# EAGLE design 06_MOV16_DestinationRegister (EAGLE 7.5.0)
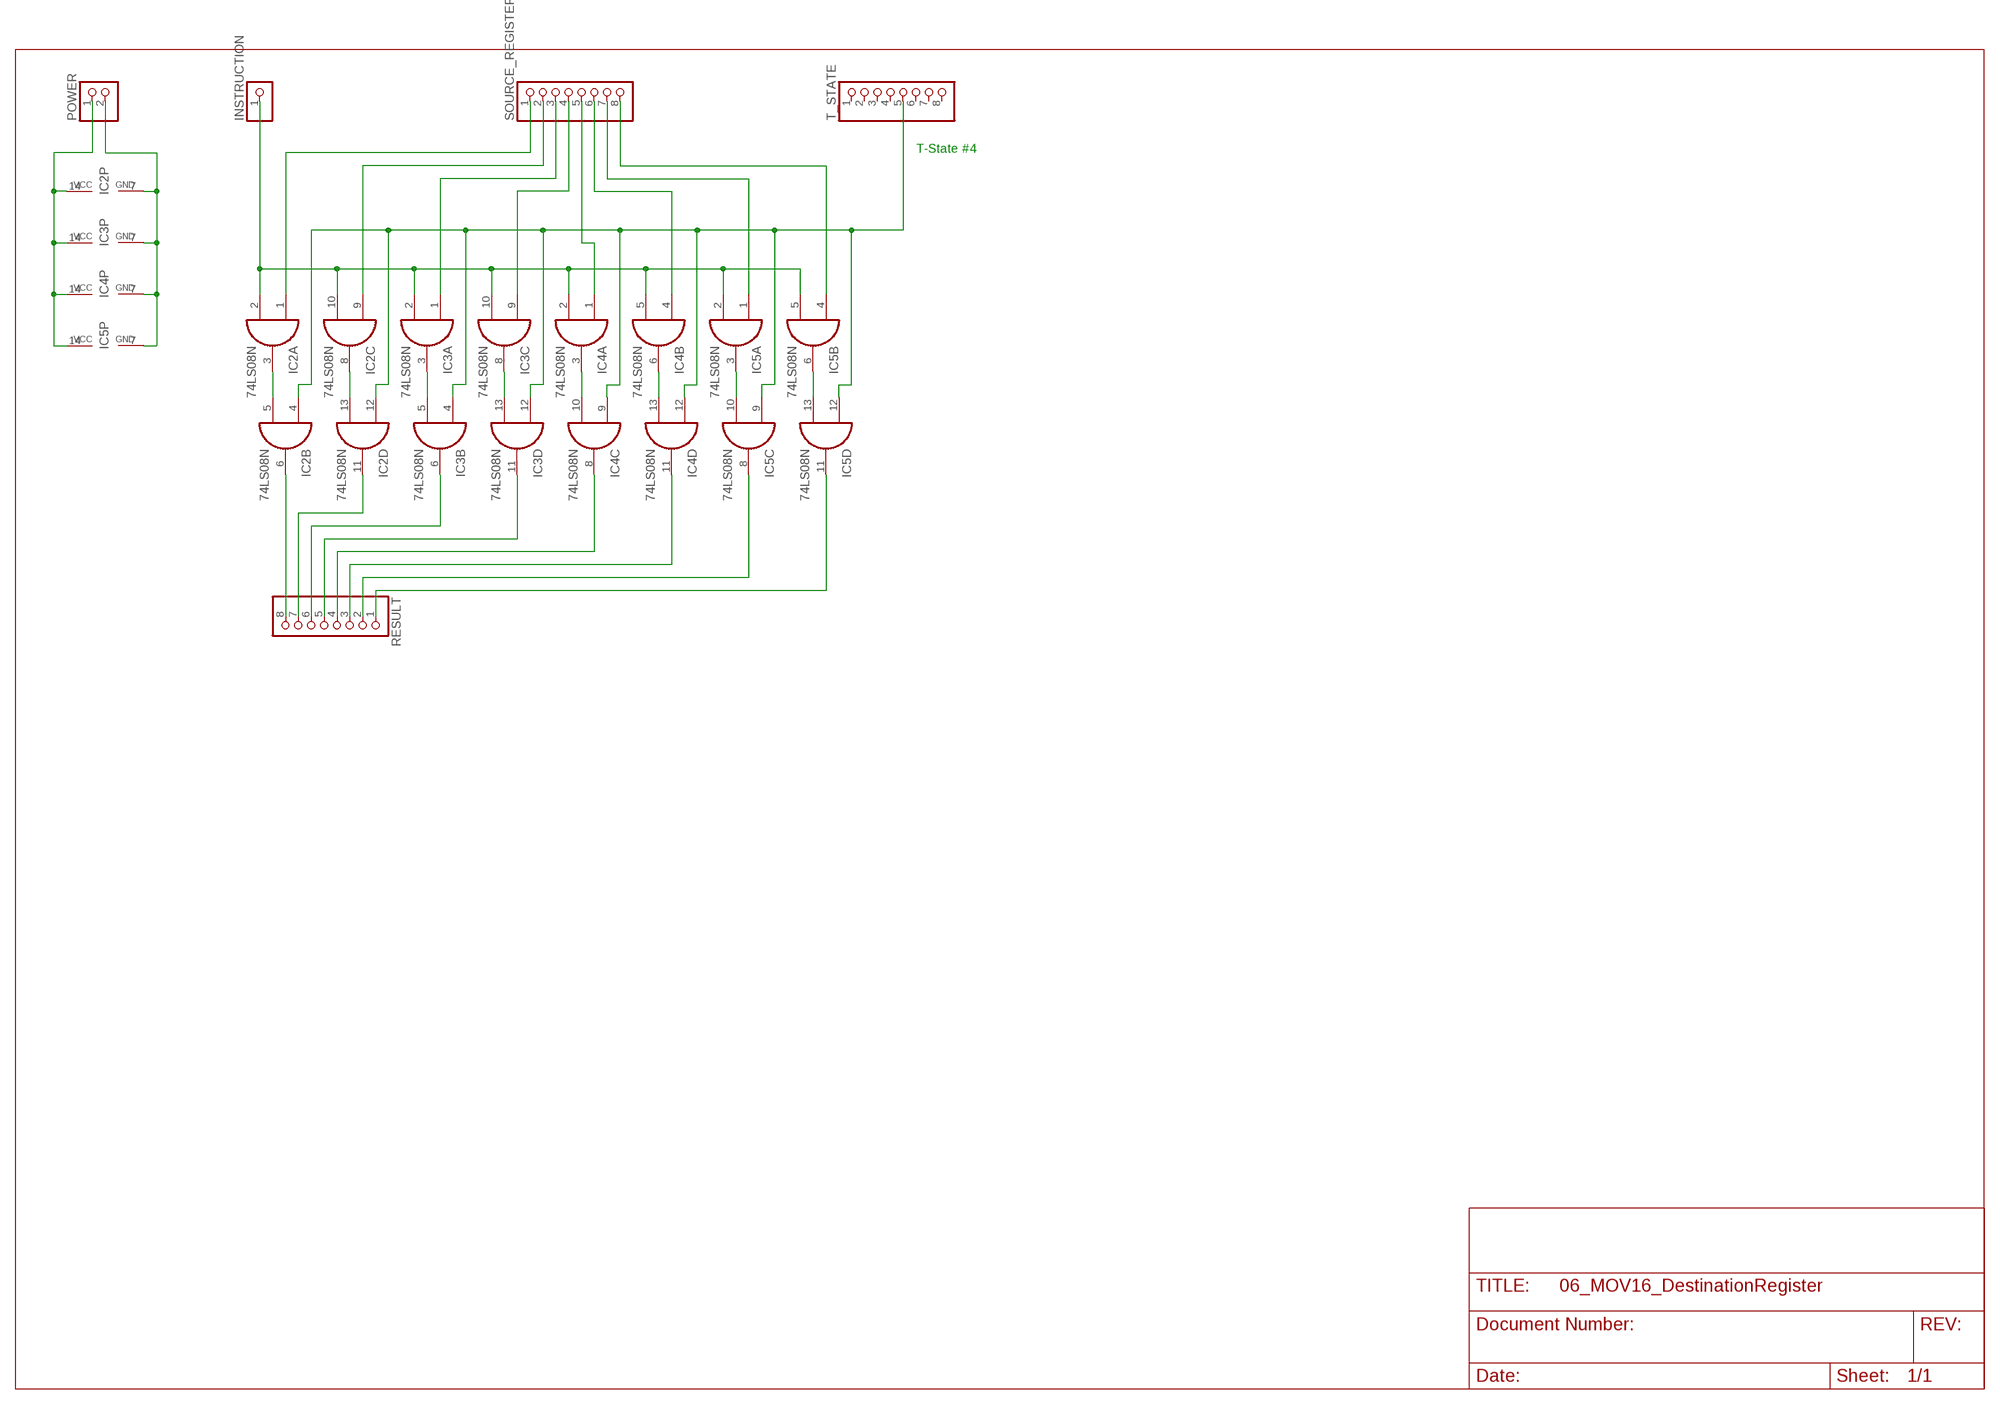
[diagram p0: schematic, sheet 1]

## Parts
IC2  74LS08N  [DIL14]
IC3  74LS08N  [DIL14]
IC4  74LS08N  [DIL14]
IC5  74LS08N  [DIL14]
INSTRUCTION  PINHD-1X1  [1X01]
POWER  PINHD-1X2  [1X02]
RESULT  PINHD-1X8  [1X08]
SOURCE_REGISTER  PINHD-1X8  [1X08]
T_STATE  PINHD-1X8  [1X08]

## Nets
GND: IC2.7(P:GND) IC3.7(P:GND) IC4.7(P:GND) IC5.7(P:GND) POWER.2
N$1: IC2.4(B:I0) IC2.12(D:I0) IC3.4(B:I0) IC3.12(D:I0) IC4.9(C:I0) IC4.12(D:I0) IC5.9(C:I0) IC5.12(D:I0) T_STATE.5
N$3: IC2.2(A:I1) IC2.10(C:I1) IC3.2(A:I1) IC3.10(C:I1) IC4.2(A:I1) IC4.5(B:I1) IC5.2(A:I1) IC5.5(B:I1) INSTRUCTION.1
N$4: IC2.1(A:I0) SOURCE_REGISTER.1
N$5: IC2.3(A:O) IC2.5(B:I1)
N$7: IC2.6(B:O) RESULT.8
N$8: IC2.9(C:I0) SOURCE_REGISTER.2
N$9: IC2.8(C:O) IC2.13(D:I1)
N$10: IC3.1(A:I0) SOURCE_REGISTER.3
N$11: IC2.11(D:O) RESULT.7
N$12: IC3.3(A:O) IC3.5(B:I1)
N$13: IC3.6(B:O) RESULT.6
N$14: IC3.9(C:I0) SOURCE_REGISTER.4
N$15: IC3.8(C:O) IC3.13(D:I1)
N$16: IC3.11(D:O) RESULT.5
N$17: IC4.1(A:I0) SOURCE_REGISTER.5
N$18: IC4.3(A:O) IC4.10(C:I1)
N$20: IC4.8(C:O) RESULT.4
N$21: IC4.4(B:I0) SOURCE_REGISTER.6
N$22: IC4.6(B:O) IC4.13(D:I1)
N$24: IC4.11(D:O) RESULT.3
N$25: IC5.1(A:I0) SOURCE_REGISTER.7
N$26: IC5.3(A:O) IC5.10(C:I1)
N$27: IC5.8(C:O) RESULT.2
N$28: IC5.4(B:I0) SOURCE_REGISTER.8
N$29: IC5.6(B:O) IC5.13(D:I1)
N$31: IC5.11(D:O) RESULT.1
VCC: IC2.14(P:VCC) IC3.14(P:VCC) IC4.14(P:VCC) IC5.14(P:VCC) POWER.1
Unconnected: T_STATE.1 T_STATE.2 T_STATE.3 T_STATE.4 T_STATE.6 T_STATE.7 T_STATE.8

## Notes on the sheet
- T-State #4

## Library data of the parts
IC2-IC5 = 74xx-eu:74*08: Quad 2-input AND gate
INSTRUCTION = pinhead:PINHD-1X1: PIN HEADER
POWER = pinhead:PINHD-1X2: PIN HEADER
RESULT SOURCE_REGISTER T_STATE = pinhead:PINHD-1X8: PIN HEADER

## Board
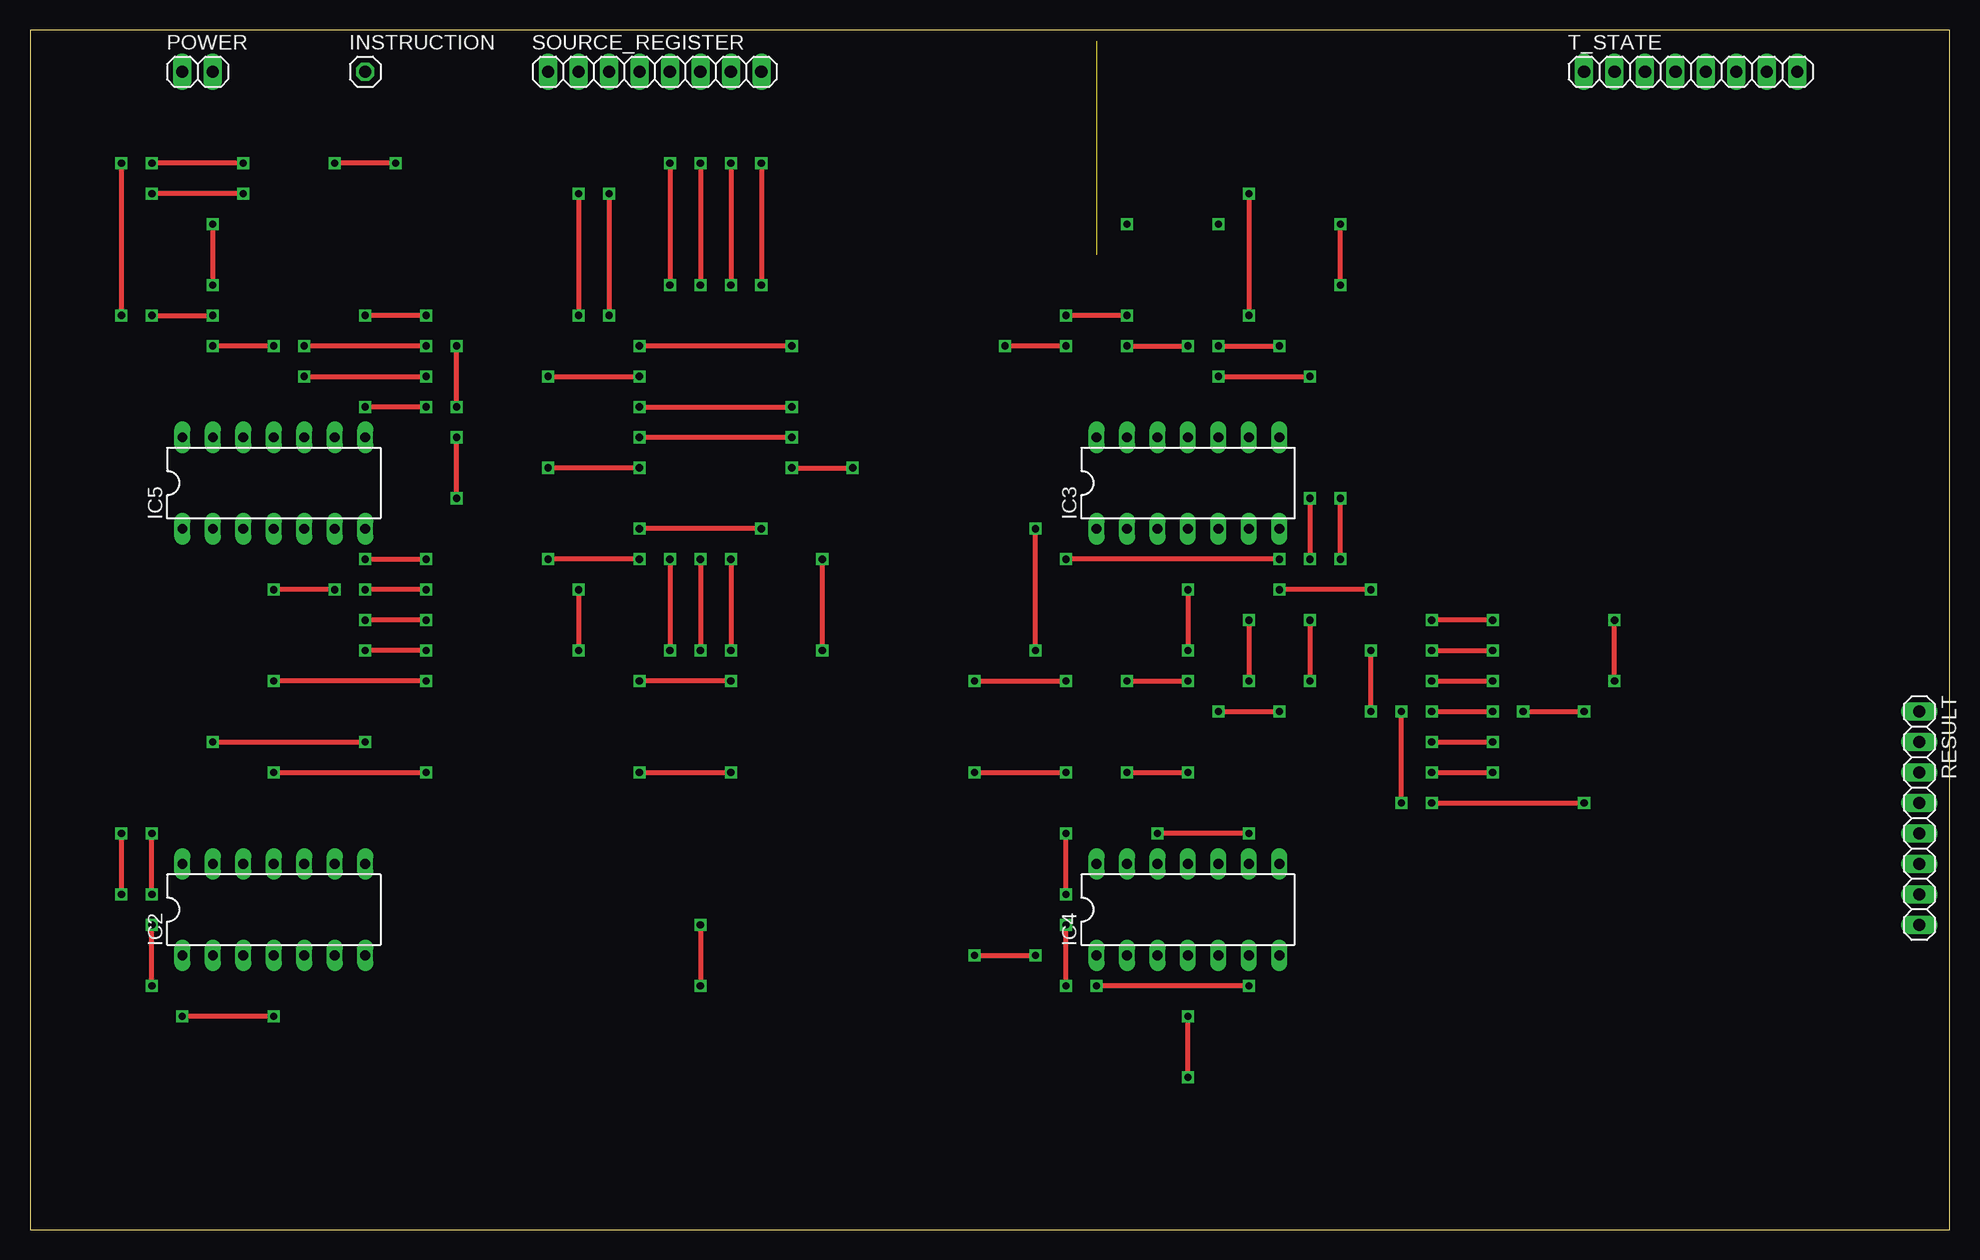
[diagram p1: board, top side]
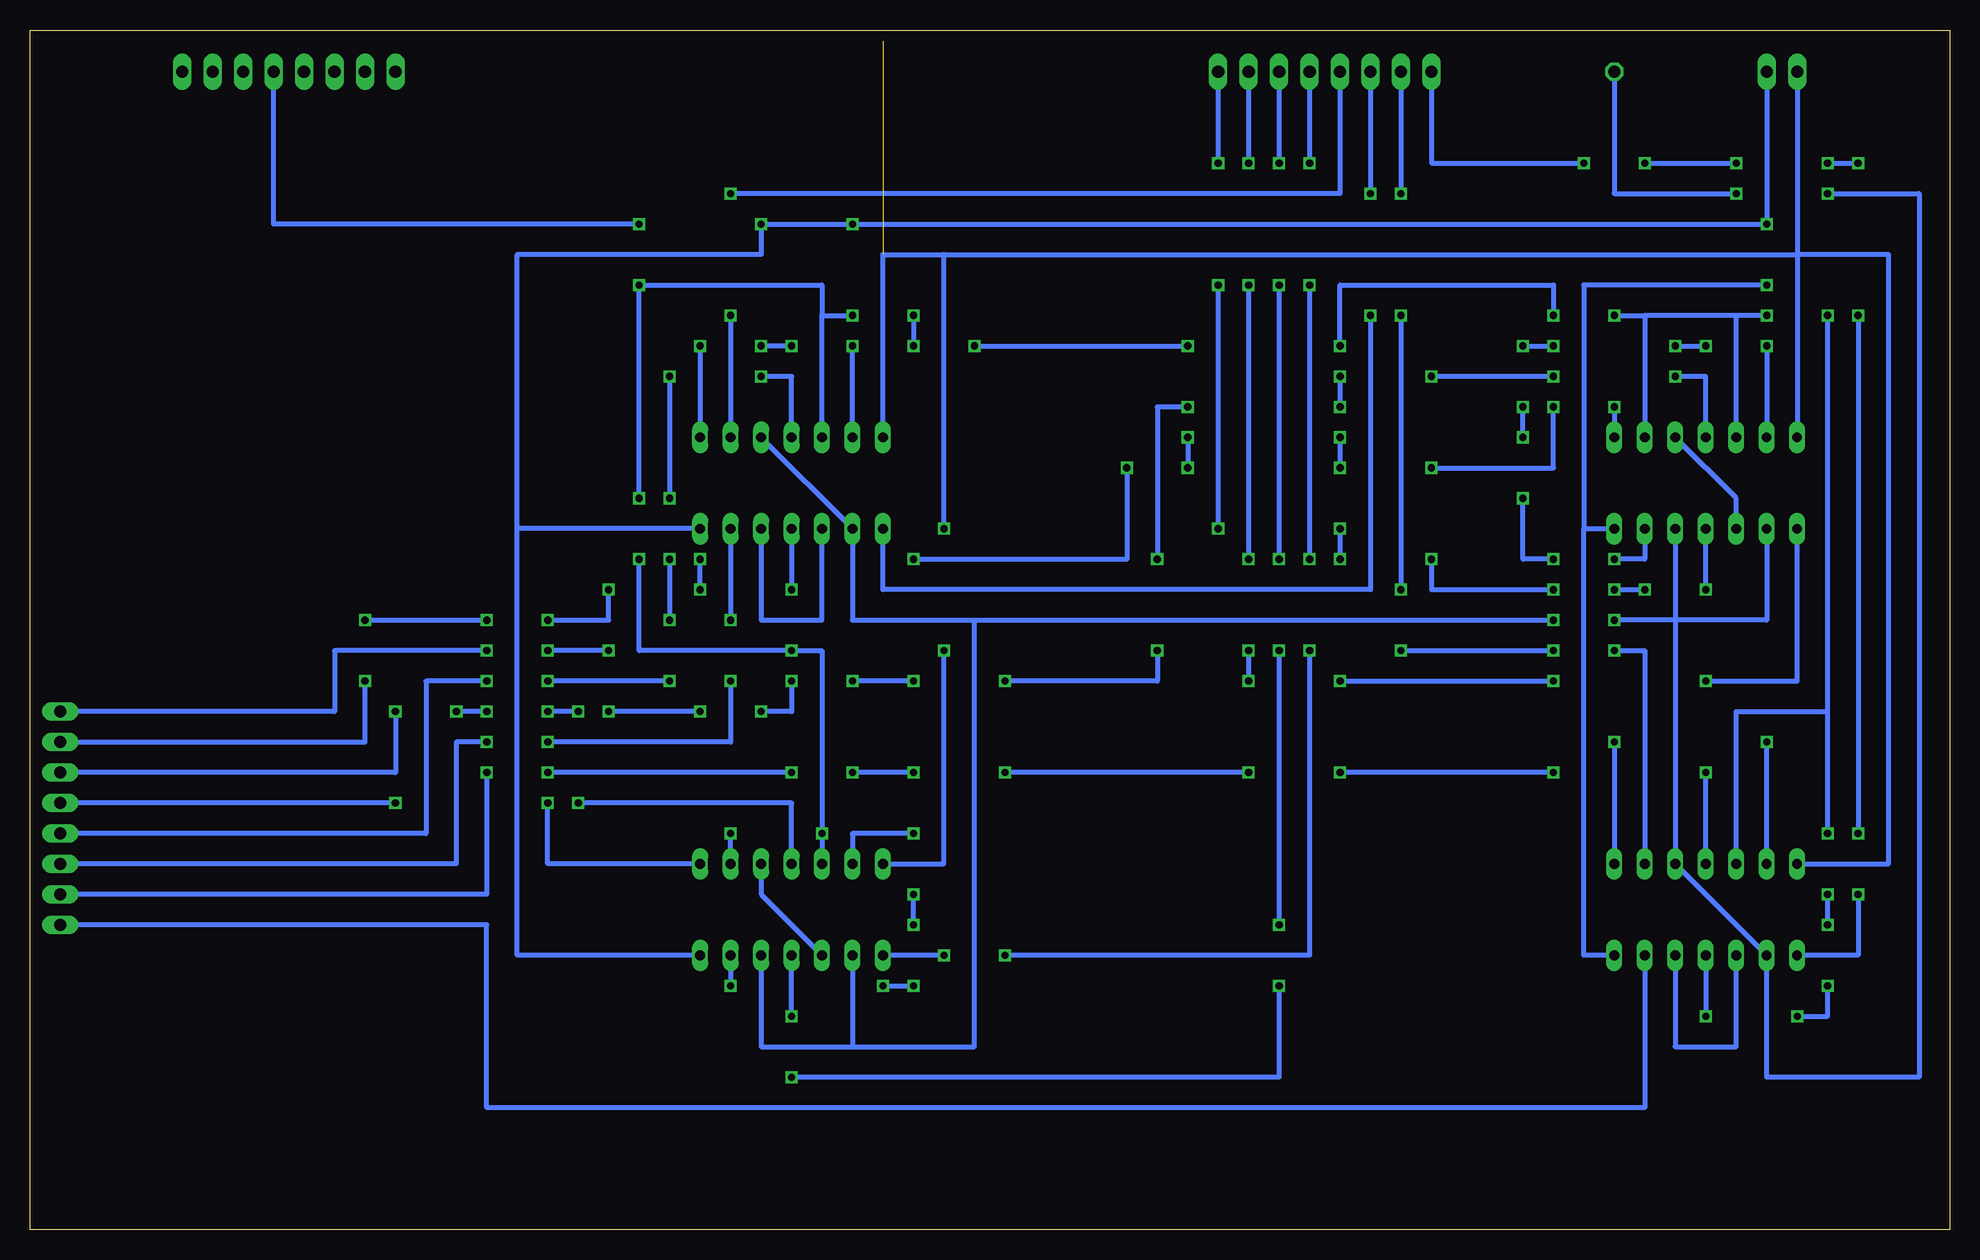
[diagram p2: board, bottom side, seen from below]

Size 160 x 100 mm. Coordinates in mm from the lower left corner, seen from the top.
Outline: 0,0 160,0 160,100 0,100 0,0
Copper layers (1*16): Top 0.035mm / dielectric 1.5mm / Bottom 0.035mm
Design rules "default": minimum track width 10mil, minimum drill 24mil, track to track 8mil, track to pad 8mil, pad to pad 8mil, via to via 8mil, smd to smd 8mil, copper to edge 40mil, drill to drill 8mil, minimum pad ring 10mil, minimum via ring 8mil, stop-mask expansion 4mil, vias tented up to drill 0mil, thermal gap 10mil

### Footprints (pad centres in the part's own frame; a part is rotated, then mirrored left to right if it is on the bottom)
DIL14 = drill 0.813 long: 1 -7.62,-3.81; 2 -5.08,-3.81; 3 -2.54,-3.81; 4 0,-3.81; 5 2.54,-3.81; 6 5.08,-3.81; 7 7.62,-3.81; 8 7.62,3.81; 9 5.08,3.81; 10 2.54,3.81; 11 0,3.81; 12 -2.54,3.81; 13 -5.08,3.81; 14 -7.62,3.81
1X01 = drill 1.016 octagon: 1 0,0
1X02 = drill 1.016 long: 1 -1.27,0; 2 1.27,0
1X08 = drill 1.016 long: 1 -8.89,0; 2 -6.35,0; 3 -3.81,0; 4 -1.27,0; 5 1.27,0; 6 3.81,0; 7 6.35,0; 8 8.89,0

### Placement (x,y rotation side)
IC2  20.32,26.67 0 top
IC3  96.52,62.23 0 top
IC4  96.52,26.67 0 top
IC5  20.32,62.23 0 top
INSTRUCTION  27.94,96.52 0 top
POWER  13.97,96.52 0 top
RESULT  157.48,34.29 270 top
SOURCE_REGISTER  52.07,96.52 0 top
T_STATE  138.43,96.52 0 top

### Tracks (layer width: path | path; a pad name or v marks a point on that pad's centre or on a via)
GND  (via drill 0.6)
  Top 0.406: v15.24,83.82 v15.24,78.74
  Bottom 0.406: POWER.2 v15.24,83.82 v99.06,83.82 99.06,81.28 119.38,81.28 119.38,58.42 | v15.24,78.74 30.48,78.74 30.48,58.42 | 30.48,58.42 IC5.7 | IC3.7 119.38,58.42 | IC4.7 119.38,22.86 119.38,58.42 | 30.48,58.42 30.48,22.86 IC2.7
  other vias: 91.44,83.82
N$1  (via drill 0.6)  (1 unrouted)
  Top 0.406: v96.52,53.34 v96.52,48.26 | v109.22,55.88 v109.22,60.96 | v10.16,76.2 v15.24,76.2 | v20.32,17.78 v12.7,17.78 | v10.16,20.32 v10.16,25.4 | v10.16,27.94 v10.16,33.02 | v101.6,33.02 v93.98,33.02 | v91.44,76.2 v86.36,76.2 | v86.36,73.66 v81.28,73.66 | v63.5,73.66 v50.8,73.66 | v33.02,76.2 v27.94,76.2 | v109.22,78.74 v109.22,83.82
  Bottom 0.406: 93.98,76.2 93.98,78.74 v109.22,78.74 v109.22,60.96 | IC3.4 v96.52,53.34 | v109.22,55.88 109.22,48.26 v96.52,48.26 93.98,48.26 v93.98,33.02 IC4.12 | IC5.12 17.78,76.2 | 17.78,76.2 25.4,76.2 | 25.4,76.2 IC5.9 | IC2.12 17.78,43.18 10.16,43.18 | 10.16,43.18 v10.16,76.2 | v15.24,76.2 17.78,76.2 | IC2.4 v20.32,17.78 | v12.7,17.78 10.16,17.78 v10.16,20.32 | v10.16,25.4 v10.16,27.94 | v10.16,33.02 10.16,43.18 | IC4.9 v101.6,33.02 | IC3.12 93.98,76.2 | 93.98,76.2 v91.44,76.2 | v86.36,76.2 v86.36,73.66 | v81.28,73.66 v63.5,73.66 | v50.8,73.66 50.8,78.74 33.02,78.74 v33.02,76.2 | v27.94,76.2 25.4,76.2 | v109.22,83.82 139.7,83.82 T_STATE.5
N$3  (via drill 0.6)
  Top 0.406: v17.78,86.36 v10.16,86.36 | v33.02,50.8 v27.94,50.8
  Bottom 0.406: INSTRUCTION.1 27.94,86.36 v17.78,86.36 | v10.16,86.36 2.54,86.36 2.54,12.7 15.24,12.7 IC2.2 IC2.10 22.86,50.8 | 22.86,50.8 v27.94,50.8 | 81.28,50.8 91.44,50.8 IC3.2 IC3.10 | 81.28,50.8 v33.02,50.8 | IC4.2 91.44,15.24 | 91.44,15.24 81.28,15.24 81.28,50.8 | IC4.5 99.06,15.24 91.44,15.24 | IC5.5 22.86,50.8 | IC5.2 15.24,50.8 22.86,50.8
N$4  (via drill 0.6)
  Top 0.406: v30.48,88.9 v25.4,88.9 | v17.78,88.9 v10.16,88.9 | v7.62,88.9 v7.62,76.2 | v7.62,33.02 v7.62,27.94
  Bottom 0.406: SOURCE_REGISTER.1 43.18,88.9 v30.48,88.9 | v25.4,88.9 v17.78,88.9 | v10.16,88.9 v7.62,88.9 | v7.62,76.2 v7.62,33.02 | v7.62,27.94 7.62,22.86 IC2.1
N$5
  Bottom 0.406: IC2.5 22.86,15.24 17.78,15.24 IC2.3
N$7
  Bottom 0.406: IC2.6 25.4,10.16 121.92,10.16 121.92,25.4 RESULT.8
N$8  (via drill 0.6)
  Top 0.406: v45.72,86.36 v45.72,76.2 | v45.72,53.34 v45.72,48.26 | v33.02,48.26 v27.94,48.26
  Bottom 0.406: SOURCE_REGISTER.2 v45.72,86.36 | v45.72,76.2 v45.72,53.34 | v45.72,48.26 v33.02,48.26 | v27.94,48.26 25.4,48.26 IC2.9
N$9  (via drill 0.6)
  Top 0.406: v15.24,40.64 v27.94,40.64
  Bottom 0.406: IC2.13 v15.24,40.64 | v27.94,40.64 IC2.8
N$10  (via drill 0.6)
  Top 0.406: v48.26,86.36 v48.26,76.2
  Bottom 0.406: SOURCE_REGISTER.3 v48.26,86.36 | v48.26,76.2 48.26,53.34 88.9,53.34 IC3.1
N$11  (via drill 0.6)
  Top 0.406: v20.32,38.1 v33.02,38.1 | v50.8,38.1 v58.42,38.1 | v78.74,38.1 v86.36,38.1 | v91.44,38.1 v96.52,38.1 | v116.84,38.1 v121.92,38.1
  Bottom 0.406: IC2.11 v20.32,38.1 | v33.02,38.1 v50.8,38.1 | v58.42,38.1 v78.74,38.1 | v86.36,38.1 v91.44,38.1 | v96.52,38.1 v116.84,38.1 | v121.92,38.1 121.92,27.94 RESULT.7
N$12
  Bottom 0.406: IC3.5 99.06,50.8 93.98,50.8 IC3.3
N$13  (via drill 0.6)
  Top 0.406: v101.6,50.8 v101.6,45.72 | v116.84,40.64 v121.92,40.64
  Bottom 0.406: IC3.6 v101.6,50.8 | v101.6,45.72 101.6,40.64 v116.84,40.64 | v121.92,40.64 124.46,40.64 124.46,30.48 RESULT.6
N$14  (via drill 0.6)
  Top 0.406: v101.6,86.36 v101.6,76.2
  Bottom 0.406: SOURCE_REGISTER.4 50.8,86.36 v101.6,86.36 | v101.6,76.2 IC3.9
N$15  (via drill 0.6)
  Top 0.406: v91.44,73.66 v96.52,73.66 | v99.06,73.66 v104.14,73.66
  Bottom 0.406: IC3.13 v91.44,73.66 | v96.52,73.66 v99.06,73.66 | v104.14,73.66 IC3.8
N$16  (via drill 0.6)
  Top 0.406: v99.06,71.12 v106.68,71.12 | v106.68,60.96 v106.68,55.88 | v106.68,50.8 v106.68,45.72 | v116.84,45.72 v121.92,45.72
  Bottom 0.406: IC3.11 96.52,71.12 v99.06,71.12 | v106.68,71.12 v106.68,60.96 | v106.68,55.88 v106.68,50.8 | v106.68,45.72 v116.84,45.72 | v121.92,45.72 127,45.72 127,33.02 RESULT.5
N$17  (via drill 0.6)
  Top 0.406: v53.34,88.9 v53.34,78.74 | v53.34,55.88 v53.34,48.26 | v78.74,22.86 v83.82,22.86
  Bottom 0.406: SOURCE_REGISTER.5 v53.34,88.9 | v53.34,78.74 v53.34,55.88 | v53.34,48.26 53.34,22.86 v78.74,22.86 | v83.82,22.86 IC4.1
N$18
  Bottom 0.406: IC4.10 99.06,27.94 IC4.3
N$20  (via drill 0.6)
  Top 0.406: v116.84,35.56 v129.54,35.56
  Bottom 0.406: IC4.8 116.84,30.48 v116.84,35.56 | v129.54,35.56 RESULT.4
N$21  (via drill 0.6)
  Top 0.406: v55.88,88.9 v55.88,78.74 | v55.88,55.88 v55.88,48.26 | v55.88,25.4 v55.88,20.32 | v96.52,12.7 v96.52,17.78
  Bottom 0.406: SOURCE_REGISTER.6 v55.88,88.9 | v55.88,78.74 v55.88,55.88 | v55.88,48.26 v55.88,25.4 | v55.88,20.32 55.88,12.7 v96.52,12.7 | v96.52,17.78 IC4.4
N$22  (via drill 0.6)
  Top 0.406: v101.6,20.32 v88.9,20.32 | v86.36,20.32 v86.36,25.4 | v86.36,27.94 v86.36,33.02
  Bottom 0.406: IC4.6 v101.6,20.32 | v88.9,20.32 v86.36,20.32 | v86.36,25.4 v86.36,27.94 | v86.36,33.02 91.44,33.02 IC4.13
N$24  (via drill 0.6)
  Top 0.406: v114.3,35.56 v114.3,43.18 | v116.84,43.18 v121.92,43.18 | v124.46,43.18 v129.54,43.18
  Bottom 0.406: IC4.11 96.52,35.56 v114.3,35.56 | v114.3,43.18 v116.84,43.18 | v121.92,43.18 v124.46,43.18 | v129.54,43.18 129.54,38.1 RESULT.3
N$25  (via drill 0.6)
  Top 0.406: v58.42,88.9 v58.42,78.74 | v58.42,55.88 v58.42,48.26 | v58.42,45.72 v50.8,45.72 | v33.02,45.72 v20.32,45.72
  Bottom 0.406: SOURCE_REGISTER.7 v58.42,88.9 | v58.42,78.74 v58.42,55.88 | v58.42,48.26 v58.42,45.72 | v50.8,45.72 v33.02,45.72 | v20.32,45.72 12.7,45.72 IC5.1
N$26
  Bottom 0.406: IC5.3 17.78,60.96 IC5.10
N$27  (via drill 0.6)
  Top 0.406: v132.08,45.72 v132.08,50.8 | v121.92,50.8 v116.84,50.8 | v111.76,53.34 v104.14,53.34 | v104.14,55.88 v86.36,55.88 | v63.5,66.04 v50.8,66.04 | v50.8,63.5 v43.18,63.5 | v33.02,68.58 v27.94,68.58 | v63.5,63.5 v68.58,63.5
  Bottom 0.406: RESULT.2 132.08,40.64 v132.08,45.72 | v132.08,50.8 v121.92,50.8 | v116.84,50.8 111.76,50.8 v111.76,53.34 | v104.14,53.34 v104.14,55.88 | v86.36,55.88 68.58,55.88 v68.58,63.5 | v50.8,66.04 v50.8,63.5 | v43.18,63.5 33.02,63.5 v33.02,68.58 | v27.94,68.58 IC5.8 | v63.5,66.04 v63.5,63.5
N$28  (via drill 0.6)
  Top 0.406: v60.96,88.9 v60.96,78.74 | v60.96,58.42 v50.8,58.42 | v50.8,55.88 v43.18,55.88 | v33.02,53.34 v27.94,53.34 | v25.4,53.34 v20.32,53.34
  Bottom 0.406: SOURCE_REGISTER.8 v60.96,88.9 | v60.96,78.74 v60.96,58.42 | v50.8,58.42 v50.8,55.88 | v43.18,55.88 43.18,53.34 v33.02,53.34 | v27.94,53.34 v25.4,53.34 | v20.32,53.34 IC5.4
N$29  (via drill 0.6)
  Top 0.406: v27.94,55.88 v33.02,55.88 | v35.56,60.96 v35.56,66.04 | v35.56,68.58 v35.56,73.66 | v33.02,73.66 v22.86,73.66 | v20.32,73.66 v15.24,73.66
  Bottom 0.406: IC5.6 25.4,55.88 v27.94,55.88 | v33.02,55.88 35.56,55.88 v35.56,60.96 | v35.56,66.04 v35.56,68.58 | v35.56,73.66 v33.02,73.66 | v22.86,73.66 v20.32,73.66 | v15.24,73.66 IC5.13
N$31  (via drill 0.6)
  Top 0.406: v22.86,71.12 v33.02,71.12 | v43.18,71.12 v50.8,71.12 | v50.8,68.58 v63.5,68.58 | v66.04,55.88 v66.04,48.26 | v78.74,45.72 v86.36,45.72 | v91.44,45.72 v96.52,45.72 | v99.06,43.18 v104.14,43.18 | v111.76,43.18 v111.76,48.26 | v116.84,48.26 v121.92,48.26
  Bottom 0.406: IC5.11 20.32,71.12 v22.86,71.12 | v33.02,71.12 v43.18,71.12 | v50.8,71.12 v50.8,68.58 | v63.5,68.58 66.04,68.58 v66.04,55.88 | v66.04,48.26 66.04,45.72 v78.74,45.72 | v86.36,45.72 v91.44,45.72 | v96.52,45.72 96.52,43.18 v99.06,43.18 | v104.14,43.18 v111.76,43.18 | v111.76,48.26 v116.84,48.26 | v121.92,48.26 134.62,48.26 134.62,43.18 RESULT.1
VCC  (via drill 0.6)  (1 unrouted)
  Top 0.406: v83.82,48.26 v83.82,58.42
  Bottom 0.406: POWER.1 12.7,81.28 | 12.7,81.28 IC5.14 | 12.7,81.28 5.08,81.28 5.08,30.48 IC2.14 | IC3.14 88.9,81.28 83.82,81.28 | 83.82,81.28 12.7,81.28 | IC4.14 83.82,30.48 v83.82,48.26 | v83.82,58.42 83.82,81.28